# EAGLE design Dev_Board_V3.5 (EAGLE 6.2)
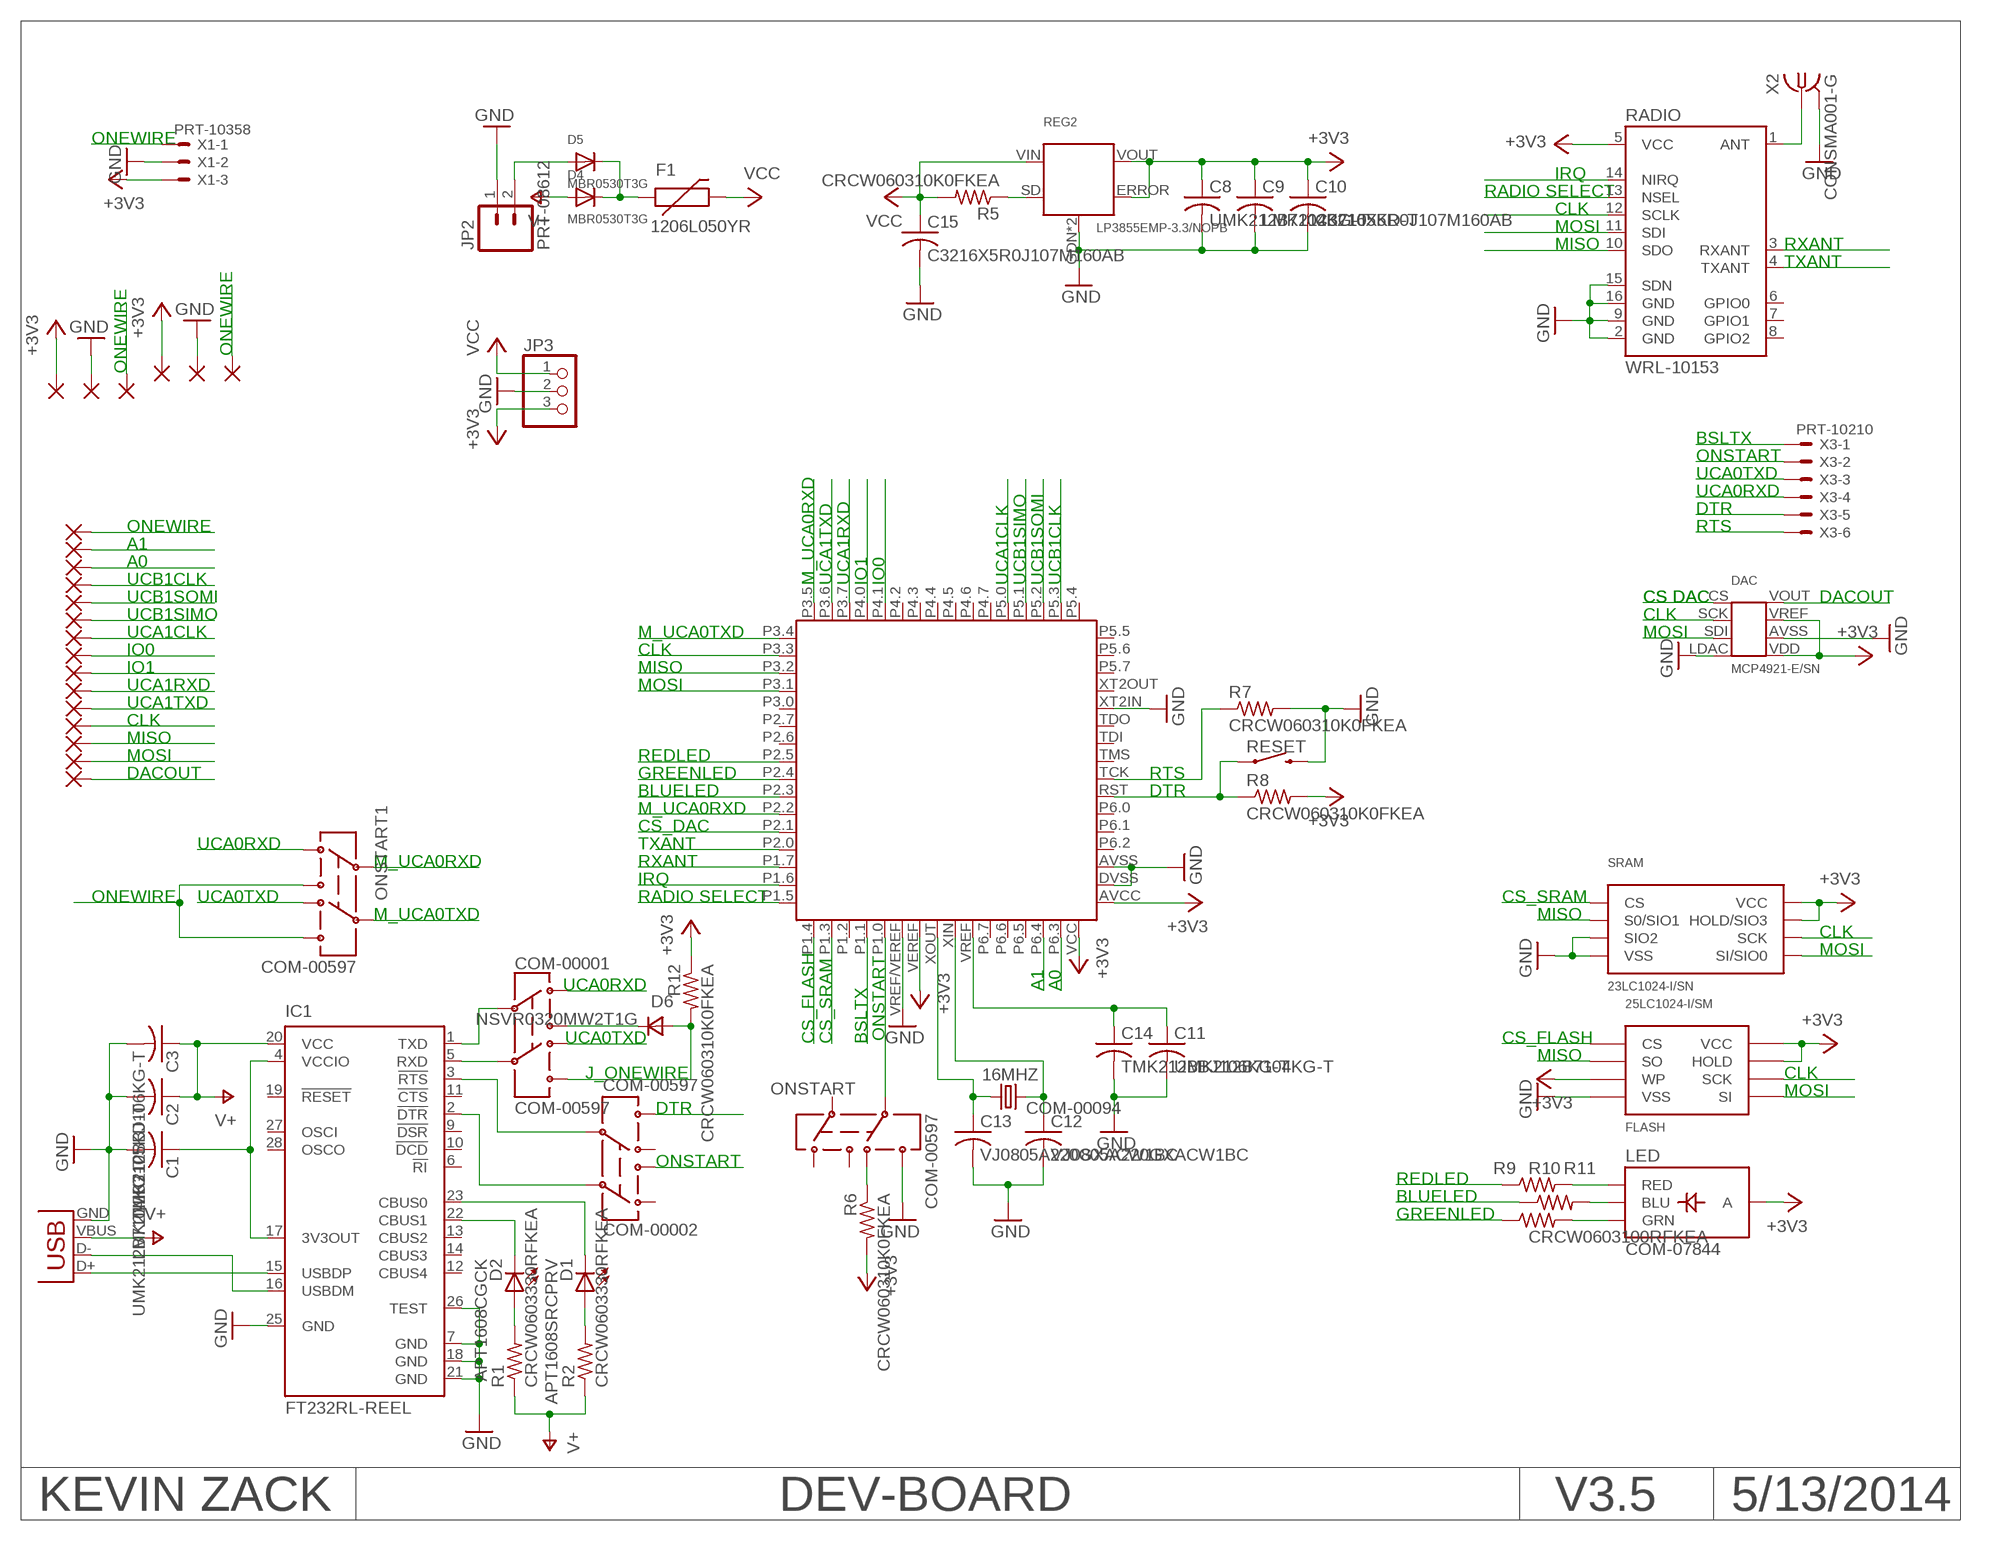
[diagram p0: schematic, sheet 1]

## Parts
16MHZ  COM-00094  CRYSTAL5X3  [CRYSTAL-SMD-5X3]
+3.1  1,6/0,9  [1,6/0,9]
+3.3  1,6/0,9  [1,6/0,9]
A0  1,6/0,9  [1,6/0,9]
A1  1,6/0,9  [1,6/0,9]
A2  1,6/0,9  [1,6/0,9]
A3  1,6/0,9  [1,6/0,9]
A4  1,6/0,9  [1,6/0,9]
C1  UMK212B7104KG-T  C-USC0805  [C0805]
C2  LMK212B7105KD-T  C-USC0805  [C0805]
C3  TMK212BBJ106KG-T  C-USC0805  [C0805]
C8  UMK212B7104KG-T  C-USC0805  [C0805]
C9  LMK212B7105KD-T  C-USC0805  [C0805]
C10  C3216X5R0J107M160AB  C-USC1206  [C1206]
C11  UMK212B7104KG-T  C-USC0805  [C0805]
C12  VJ0805A220GXACW1BC  C-USC0805  [C0805]
C13  VJ0805A220GXACW1BC  C-USC0805  [C0805]
C14  TMK212BBJ106KG-T  C-USC0805  [C0805]
C15  C3216X5R0J107M160AB  C-USC1206  [C1206]
CLK  1,6/0,9  [1,6/0,9]
COM-00001  COM-00597  SWITCH-DPDTAYZ0202  [AYZ0202]
COM-00002  COM-00597  SWITCH-DPDTAYZ0202  [AYZ0202]
D1  APT1608SRCPRV  LED-RED0603  [LED-0603]
D2  APT1608CGCK  LED-GREEN0603  [LED-0603]
D4  MBR0530T3G  DIODESOD-123  [SOD-123]
D5  MBR0530T3G  DIODESOD-123  [SOD-123]
D6  NSVR0320MW2T1G  DSOD323  [SOD323]
DAC  MCP4921-E/SN  MCP4921_SMD  [MCP4921_SMD]
DACOUT  1,6/0,9  [1,6/0,9]
F1  1206L050YR  PTCSMD  [PTC-1206]
FLASH  25LC1024-I/SM  25LC1024  [25LC1024]
GND  1,6/0,9  [1,6/0,9]
GND26  1,6/0,9  [1,6/0,9]
IC1  FT232RL-REEL  FT232RL  [SSOP28]
IO0  1,6/0,9  [1,6/0,9]
IO1  1,6/0,9  [1,6/0,9]
JP1  1734035-2  USB-SMD-NS  [USB-MINIB-NOSTOP]
JP2  PRT-08612  M02-JST-2MM-SMT  [JST-2-SMD]
JP3  PINHD-1X3  [1X03]
LED  COM-07844  LED-TRICOLOR  [LED-TRICOLOR-SMD]
MISO  1,6/0,9  [1,6/0,9]
MOSI  1,6/0,9  [1,6/0,9]
ONSTART  COM-00597  SWITCH-DPDTAYZ0202  [AYZ0202]
ONSTART1  COM-00597  SWITCH-DPDTAYZ0202  [AYZ0202]
R1  CRCW0603330RFKEA  R-US_R0603  [R0603]
R2  CRCW0603330RFKEA  R-US_R0603  [R0603]
R5  CRCW060310K0FKEA  R-US_R0603  [R0603]
R6  CRCW060310K0FKEA  R-US_R0603  [R0603]
R7  CRCW060310K0FKEA  R-US_R0603  [R0603]
R8  CRCW060310K0FKEA  R-US_R0603  [R0603]
R9  CRCW0603100RFKEA  R-US_R0603  [R0603]
R10  CRCW0603100RFKEA  R-US_R0603  [R0603]
R11  CRCW0603100RFKEA  R-US_R0603  [R0603]
R12  CRCW060310K0FKEA  R-US_R0603  [R0603]
RADIO  WRL-10153  RFM22SMD  [RFM22-XXX-S2]
REG2  LP3855EMP-3.3/NOPB  LP3855EMP  [LP3855EMP]
RESET  COM-08720  SWITCH-MOMENTARY-2SMD  [TACTILE_SWITCH_SMD]
SRAM  23LC1024-I/SN  23LC1024  [23LC1024]
U$3  MSP430F2410TPMR  MSP430F248  [MSP430F248]
UCA1CLK  1,6/0,9  [1,6/0,9]
UCA1RXD  1,6/0,9  [1,6/0,9]
UCA1TXD  1,6/0,9  [1,6/0,9]
UCB1CLK  1,6/0,9  [1,6/0,9]
UCB1SIMO  1,6/0,9  [1,6/0,9]
UCB1SOMI  1,6/0,9  [1,6/0,9]
X1  PRT-10358  BM03B-SRSS-TB  [BM03B-SRSS-TB]
X2  CONSMA001-G  BU-SMA-V  [BU-SMA-V]
X3  PRT-10210  SM06B-SRSS-TB  [SM06B-SRSS-TB]

## Nets
+3V3: +3.1.1(P) +3.3.1(P) C8.1 C9.1 C10.1 DAC.VDD DAC.VREF FLASH.HOLD FLASH.VCC FLASH.WP JP3.3 LED.A R6.2 R8.2 R12.1 RADIO.5(VCC) REG2.ERROR REG2.VOUT SRAM.HOLD/SIO3 SRAM.VCC U$3.AVCC U$3.VCC(DVCC) U$3.VEREF X1.3
A0: A0.1(P) U$3.P6.3
A1: A1.1(P) U$3.P6.4
BLUELED: R10.1 U$3.P2.3
BSLTX: U$3.P1.1 X3.1
CLK: CLK.1(P) DAC.SCK FLASH.SCK RADIO.12(SCLK) SRAM.SCK U$3.P3.3
CS_DAC: DAC.CS U$3.P2.1
CS_FLASH: FLASH.CS U$3.P1.4
CS_SRAM: SRAM.CS U$3.P1.3
CSRADIO: RADIO.13(NSEL) U$3.P1.5
DACOUT: DAC.VOUT DACOUT.1(P)
DTR: COM-00002.6 R8.1 RESET.1 U$3.RST X3.5
GND: C1.2 C2.2 C3.2 C8.2 C9.2 C10.2 C11.2 C12.2 C13.2 C14.2 C15.2 DAC.AVSS(VCC) DAC.LDAC(LADC) FLASH.VSS GND26.1(P) GND.1(P) IC1.7(GND) IC1.18(GND) IC1.21(GND) IC1.25(GND) IC1.26(TEST) JP1.GND JP2.1 JP3.2 ONSTART.6 R7.2 RADIO.2(GND) RADIO.9(GND) RADIO.15(SDN) RADIO.16(GND) REG2.GDN(GND) REG2.GND RESET.3 SRAM.SIO2 SRAM.VSS U$3.AVSS U$3.DVSS U$3.VREF/VEREF U$3.XT2IN X1.2 X2.2(GND)
GREENLED: R11.1 U$3.P2.4
IO0: IO0.1(P) U$3.P4.1
IO1: IO1.1(P) U$3.P4.0
IRQ: RADIO.14(NIRQ) U$3.P1.6
M_UCA0RXD: ONSTART1.2 U$3.P2.2 U$3.P3.5
M_UCA0TXD: ONSTART1.5 U$3.P3.4
MISO: FLASH.SO MISO.1(P) RADIO.10(SDO) SRAM.SO/SIO1(S0/SIO1) U$3.P3.2
MOSI: DAC.SDI FLASH.SI MOSI.1(P) RADIO.11(SDI) SRAM.SI/SIO0 U$3.P3.1
N$5: D1.C IC1.23(CBUS0)
N$7: IC1.16(USBDM) JP1.D-
N$8: IC1.15(USBDP) JP1.D+
N$9: C1.1 IC1.4(VCCIO) IC1.17(3V3OUT)
N$10: D2.C IC1.22(CBUS1)
N$11: D2.A R1.2
N$12: D1.A R2.2
N$13: R5.1 REG2.SD
N$14: D5.A JP2.2
N$15: COM-00001.5 IC1.5(RXD)
N$16: ONSTART.4 R6.1
N$17: LED.R(RED) R9.2
N$18: RADIO.1(ANT) X2.1
N$21: LED.B(BLU) R10.2
N$22: C11.1 C14.1 U$3.VREF
N$24: LED.G(GRN) R11.2
N$26: COM-00001.3 D6.1(C)
N$28: D4.C D5.C F1.1
N$29: COM-00002.5 IC1.3(!RTS)
N$30: 16MHZ.1 C13.1 U$3.XOUT
N$31: 16MHZ.3 C12.1 U$3.XIN
N$39: COM-00001.2 IC1.1(TXD)
N$43: COM-00001.6 D6.2(A) R12.2
N$44: COM-00002.2 IC1.2(!DTR)
ONEWIRE: A2.1(P) A3.1(P) A4.1(P) ONSTART1.3 ONSTART1.6 X1.1
ONSTART: COM-00002.3 ONSTART.5 U$3.P1.0 X3.2
REDLED: R9.1 U$3.P2.5
RTS: R7.1 U$3.TCK X3.6
RXANT: RADIO.3(RXANT) U$3.P1.7
TXANT: RADIO.4(TXANT) U$3.P2.0
UCA0RXD: COM-00001.1 ONSTART1.1 X3.4
UCA0TXD: COM-00001.4 ONSTART1.4 X3.3
UCA1CLK: U$3.P5.0 UCA1CLK.1(P)
UCA1RXD: U$3.P3.7 UCA1RXD.1(P)
UCA1TXD: U$3.P3.6 UCA1TXD.1(P)
UCB1CLK: U$3.P5.3 UCB1CLK.1(P)
UCB1SIMO: U$3.P5.1 UCB1SIMO.1(P)
UCB1SOMI: U$3.P5.2 UCB1SOMI.1(P)
V+: C2.1 C3.1 D4.A IC1.20(VCC) JP1.VBUS R1.1 R2.1
VCC: C15.1 F1.2 JP3.1 R5.2 REG2.VIN
Unconnected: COM-00002.1 COM-00002.4 IC1.6(!RI) IC1.9(!DSR) IC1.10(!DCD) IC1.11(!CTS) IC1.12(CBUS4) IC1.13(CBUS2) IC1.14(CBUS3) IC1.19(!RESET) IC1.27(OSCI) IC1.28(OSCO) ONSTART.1 ONSTART.2 ONSTART.3 RADIO.6(GPIO0) RADIO.7(GPIO1) RADIO.8(GPIO2) U$3.P1.2 U$3.P2.6 U$3.P2.7 U$3.P3.0 U$3.P4.2 U$3.P4.3 U$3.P4.4 U$3.P4.5 U$3.P4.6 U$3.P4.7 U$3.P5.4 U$3.P5.5 U$3.P5.6 U$3.P5.7 U$3.P6.0 U$3.P6.1 U$3.P6.2 U$3.P6.5 U$3.P6.6 U$3.P6.7 U$3.TDI U$3.TDO U$3.TMS U$3.XT2OUT

## Notes on the sheet
- ONEWIRE
- IRQ
- RADIO SELECT
- CLK
- MOSI
- MISO | RXANT
- TXANT
- ONEWIRE
- ONEWIRE
- BSLTX
- ONSTART
- UCA0TXD
- UCA0RXD
- DTR
- ONEWIRE | RTS
- A1
- A0
- UCB1CLK | M_UCA0RXD | UCA1TXD | UCA1RXD | IO1 | IO0 | UCA1CLK | UCB1SIMO | UCB1SOMI | UCB1CLK
- UCB1SOMI | CS DAC | CS DAC | DACOUT
- UCB1SIMO | CLK
- UCA1CLK | M_UCA0TXD | MOSI
- IO0 | CLK
- IO1 | MISO
- UCA1RXD | MOSI
- UCA1TXD
- CLK
- MISO
- MOSI | REDLED
- DACOUT | GREENLED | RTS
- BLUELED | DTR
- M_UCA0RXD
- CS_DAC
- UCA0RXD | TXANT
- M_UCA0RXD | RXANT
- IRQ
- ONEWIRE | UCA0TXD | RADIO SELECT | CS_SRAM
- M_UCA0TXD | MISO
- CLK
- ONSTART | MOSI
- UCA0RXD | A1 | A0
- UCA0TXD | CS_FLASH | CS_SRAM | BSLTX | CS_FLASH
- MISO
- J_ONEWIRE | CLK
- MOSI
- DTR
- ONSTART
- REDLED
- BLUELED
- GREENLED
- KEVIN ZACK | DEV-BOARD | V3.5 | 5/13/2014

## Power pins joined to a net without a drawn wire
GND: X2.3(GND) X2.4(GND) X2.5(GND)

## Library data of the parts
16MHZ = SparkFun-FreqCtrl:CRYSTAL: Various standard crystals. Proven footprints. Spark Fun Electronics SKU : COM-00534
+3.1 +3.3 A0 A1-A4 CLK DACOUT GND GND26 IO0 IO1 MISO MOSI UCA1CLK UCA1RXD UCA1TXD UCB1CLK UCB1SIMO UCB1SOMI = wirepad:1,6/0,9: THROUGH-HOLE PAD
C1-C3 C8-C15 = rcl:C-US: CAPACITOR, American symbol
COM-00001 COM-00002 ONSTART ONSTART1 = SparkFun-Electromechanical:SWITCH-DPDT: DPDT Version of the COM-00597; PROD_ID: SWCH-08179; VALUE: DPDT
D1 = SparkFun-LED:LED-RED: Assorted Red LEDs LilyPad 1206- DIO-09912 1206- DIO-00809 0603- DIO-00819; PROD_ID: DIO-00819; VALUE: RED
D2 = SparkFun-LED:LED-GREEN: Various green LEDs 0603- DIO-00821 LARGE- DIO-00862 LILYPAD- DIO-09910; PROD_ID: DIO-00821; VALUE: GREEN
D4 D5 = adafruit:DIODE: Diode SMADIODE - SMA Surface Mount Package 20V 1A Schottky Diode Digikey: 641-1014-6-ND DO-1N4148 - Through Hole Small Current Diode SOD-123 20V 1 A (.5mV Vf) Schottky Diode - Digikey: MBRX120TPMSCT-ND SOD-323 10V 570mA (.38mV Vf, 3ns) Schottky Diode - Digikey: ZLLS410CT-ND SOD-523 30V 30mA Schottky Diode (RB751S-40TE61) - Digikey: RB751S-40TE61CT-ND SOT23-R/W - SOT23 Package (R = Solder Paste/Reflow Ovens, W = Hand-Soldering) BAT54Film 40V 300mA - Digikey: 497-7162-1-ND
D6 = zetex:D: DIODE; MPN: CDSOD323-T05C; OC_FARNELL: 1824860; OC_NEWARK: 79R6078
DAC = PocketCube:MCP4921_SMD
F1 = SparkFun-PowerIC:PTC: Resettable Fuse PTC Resettable Fuse. Spark Fun Electronics SKU : COM-08357
FLASH = PocketCube:25LC1024
IC1 = ftdichip:FT232R: Source: http://www.ftdichip.com/Documents/DataSheets/DS_FT232R_v104.pdf; MPN: FT232RL; OC_FARNELL: 1146032; OC_NEWARK: 91K9918
JP1 = SparkFun-Connectors:USB: USB Connectors USB-B-PTH is fully proven SKU : PRT-00139/CONN-08278 USB-miniB is fully proven SKU : PRT-00587 USB-A-PCB is untested. USB-A-H is throughly reviewed, but untested. Spark Fun Electronics SKU : PRT-00437 USB-B-SMT is throughly reviewed, but untested. Needs silkscreen touching up. USB-A-S has not been used/tested USB-MB-H has not been used/tested USB-MICROB has been used. CONN-09505
JP2 = SparkFun-Connectors:M02: Header 2 Standard 2-pin 0.1" header. Use with straight break away headers (SKU : PRT-00116), right angle break away headers (PRT-00553), swiss pins (PRT-00743), machine pins (PRT-00117), and female headers (PRT-00115). Molex polarized connector foot print use with SKU : PRT-08233 with associated crimp pins and housings.; PROD_ID: CONN-08352
JP3 = adafruit:PINHD-1X3: PIN HEADER
LED = SparkFun-LED:LED-TRICOLOR: Tri-Color LED SMD Proven layout and schematic for triple color LED in SMD package - common anode. Spark Fun Electronics SKU : COM-07844
R1 R2 R5-R12 = rcl:R-US_: RESISTOR, American symbol
RADIO = SparkFun-RF:RFM22: The RFM22 is a low-power, low cost radio that is capable of operating in the 434MHz and 900MHz open bands. It's frequency is software defined and there are some very good libraries written for it.
REG2 = PocketCube:LP3855EMP
RESET = SparkFun-Electromechanical:SWITCH-MOMENTARY-2: Various NO switches- pushbuttons, reed, etc
SRAM = PocketCube:23LC1024
U$3 = PocketCube:MSP430F248
X1 = con-jst2:?M03B-SRSS-TB: Disconnectable Crimp style connector, 1.0mm pitch 3 contacts
X2 = con-coax:BU-SMA-V: FEMALE SMA CONNECTOR Radiall distributor RS 112-3794; OC_FARNELL: unknown; OC_NEWARK: unknown
X3 = con-jst2:?M06B-SRSS-TB: Disconnectable Crimp style connector, 1.0mm pitch 6 contacts

## Board
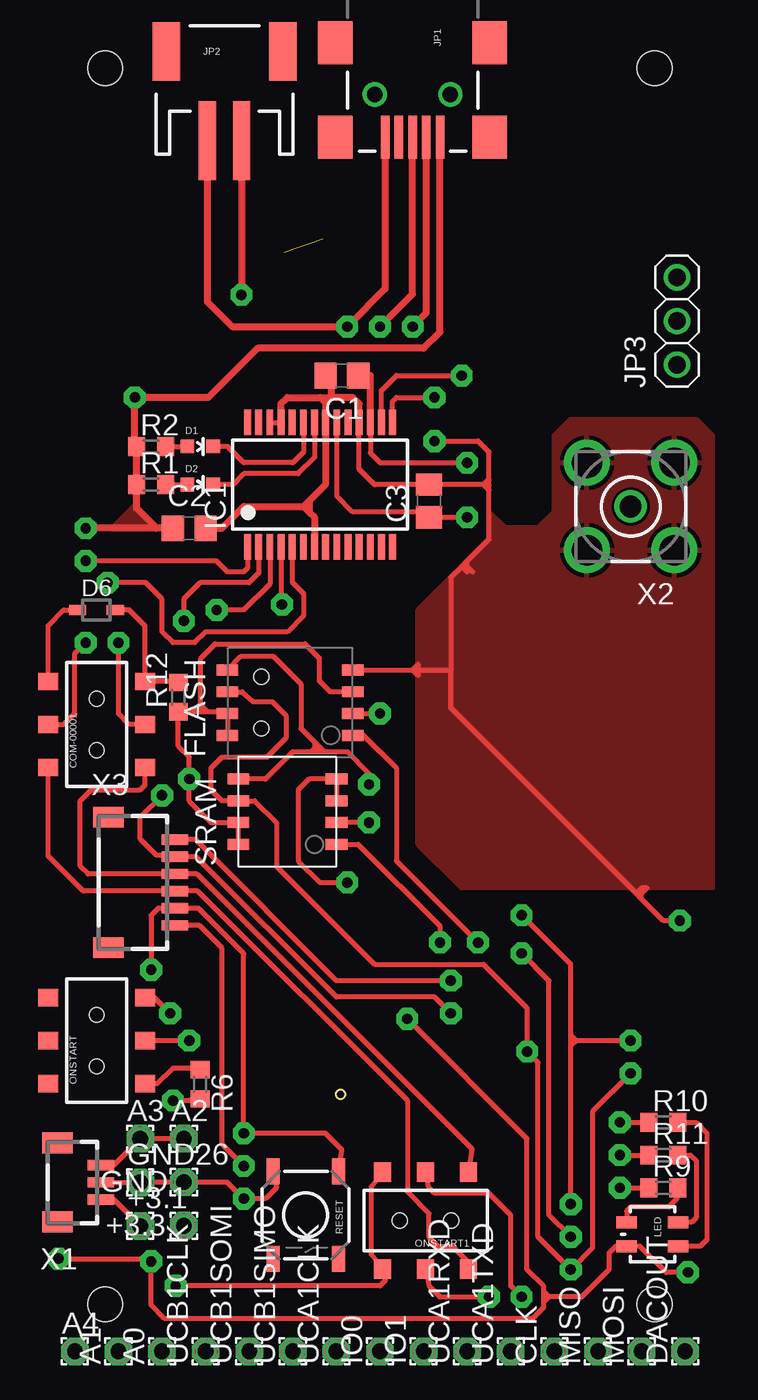
[diagram p1: board, top side]
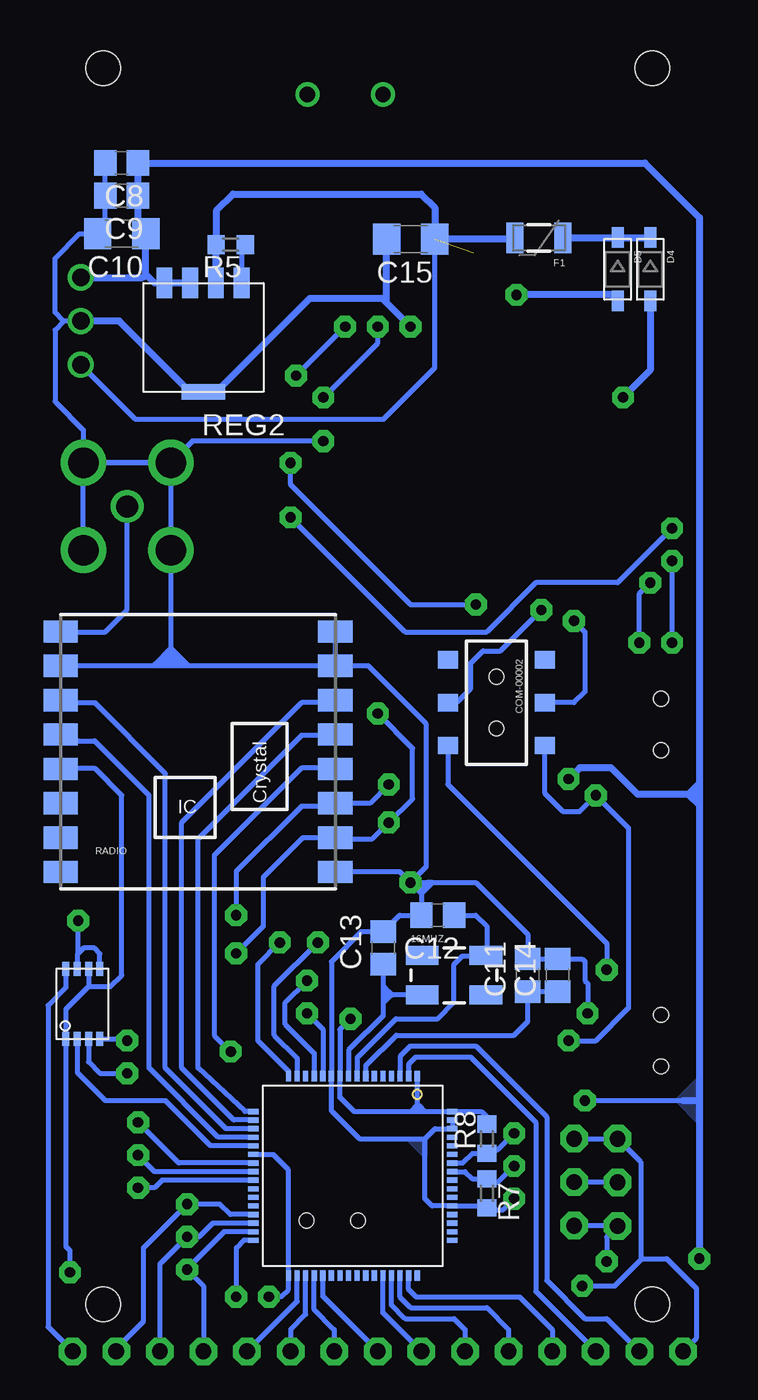
[diagram p2: board, bottom side, seen from below]

Size 0.5 x 0.5 mm. Coordinates in mm from the lower left corner, seen from the top.
Copper layers (1*16): Top 0.035mm / dielectric 1.5mm / Bottom 0.035mm
Design rules: minimum track width 10mil, minimum drill 24mil, track to track 6mil, track to pad 6mil, pad to pad 6mil, via to via 6mil, smd to smd 6mil, copper to edge 20mil, drill to drill 10mil, minimum pad ring 10mil, minimum via ring 8mil, stop-mask expansion 4mil, vias tented up to drill 0mil, thermal gap 10mil
Holes 2 mm at -13.46,-11.99 18.54,-11.99 18.54,60.01 -13.46,60.01

### Footprints (pad centres in the part's own frame; a part is rotated, then mirrored left to right if it is on the bottom)
CRYSTAL-SMD-5X3 = smd 1.9 x 1.1: 1 -1.85,-1.15; 2 1.85,-1.15; 3 1.85,1.15; 4 -1.85,1.15
1,6/0,9 = drill 0.914 pad 1.6 octagon: 1 0,0
C0805 = smd 1.3 x 1.5: 1 -0.95,0; 2 0.95,0
C1206 = smd 1.6 x 1.8: 1 -1.4,0; 2 1.4,0
AYZ0202 = smd 1 x 1.15: 1 -2.5,2.825; 2 0,2.825; 3 2.5,2.825; 4 -2.5,-2.825; 5 0,-2.825; 6 2.5,-2.825 | hole 0.85: 1.5,0; -1.5,0
LED-0603 = smd 0.8 x 0.8: A 0,-0.75; C 0,0.75
SOD-123 = smd 1.2 x 0.7: A 1.85,0; C -1.85,0
SOD323 = smd 1 x 0.6: 1 -1.1,0; 2 1.1,0
MCP4921_SMD = smd 0.813 x 0.406: AVSS 4.504,1.323; CS 0.414,1.322; LDAC 4.504,0.002; SCK 0.414,0.661; SDI 0.414,0.001; VDD 0.414,1.982; VOUT 4.504,1.983; VREF 4.504,0.662
PTC-1206 = smd 1 x 1.8: 1 -1.4,0; 2 1.4,0
25LC1024 = smd 0.635 x 1.27: CS 0,0; HOLD 1.27,7.303; SCK 2.54,7.303; SI 3.81,7.303; SO 1.27,0; VCC 0,7.303; VSS 3.81,0; WP 2.54,0
SSOP28 = smd 0.4 x 1.5: 1 -4.225,-3.625; 2 -3.575,-3.625; 3 -2.925,-3.625; 4 -2.275,-3.625; 5 -1.625,-3.625; 6 -0.975,-3.625; 7 -0.325,-3.625; 8 0.325,-3.625; 9 0.975,-3.625; 10 1.625,-3.625; 11 2.275,-3.625; 12 2.925,-3.625; 13 3.575,-3.625; 14 4.225,-3.625; 15 4.225,3.625; 16 3.575,3.625; 17 2.925,3.625; 18 2.275,3.625; 19 1.625,3.625; 20 0.975,3.625; 21 0.325,3.625; 22 -0.325,3.625; 23 -0.975,3.625; 24 -1.625,3.625; 25 -2.275,3.625; 26 -2.925,3.625; 27 -3.575,3.625; 28 -4.225,3.625
USB-MINIB-NOSTOP = smd 2.5 x 0.5: D+ 2.5,0; D- 2.5,0.8; GND 2.5,-1.6; ID 2.5,-0.8; VBUS 2.5,1.6 | smd 2.5 x 2: G1 -3,-4.5; G2 -3,4.5; G3 2.5,4.5; G4 2.5,-4.5 | drill 0.9 pad 0.8: H1 0,2.2 | drill 0.9 pad 0.787: H2 0,-2.2
JST-2-SMD = smd 1 x 4.6: 1 -1,-3.7; 2 1,-3.7 | smd 1.6 x 3.4: NC1 -3.4,1.5; NC2 3.4,1.5
1X03 = drill 1.016: 1 -2.54,0; 2 0,0; 3 2.54,0
LED-TRICOLOR-SMD = smd 0.7 x 1.2: A 0.7,-1.5; B 0.7,1.5; G -0.7,1.5; R -0.7,-1.5
R0603 = smd 1 x 1.1: 1 -0.85,0; 2 0.85,0
RFM22-XXX-S2 = smd 2 x 1.3: 1 -8,7; 2 -8,5; 3 -8,3; 4 -8,1; 5 -8,-1; 6 -8,-3; 7 -8,-5; 8 -8,-7; 9 8,-7; 10 8,-5; 11 8,-3; 12 8,-1; 13 8,1; 14 8,3; 15 8,5; 16 8,7
LP3855EMP = smd 0.914 x 1.778: ERROR 4.5,0; SD 0,0; VIN 1.5,0; VOUT 3,0 | smd 1.778 x 0.914: GDN 2.603,6.35; GND 1.841,6.35
TACTILE_SWITCH_SMD = smd 1.524 x 0.762: 1 -2.54,1.905; 2 2.54,1.905; 3 -2.54,-1.905; 4 2.54,-1.905
23LC1024 = smd 0.635 x 1.27: CS 0,0; HOLD/SIO3 1.27,5.715; SCK 2.54,5.715; SI/SIO0 3.81,5.715; SIO2 2.54,0; SO/SIO1 1.27,0; VCC 0,5.715; VSS 3.81,0
MSP430F248 = smd 0.305 x 0.61: AVCC 0,11.85; AVSS 1,11.85; DVSS 0.5,11.85; P1.5 0,0.25; P1.6 0.5,0.25; P1.7 1,0.25; P2.0 1.5,0.25; P2.1 2,0.25; P2.2 2.5,0.25; P2.3 3,0.25; P2.4 3.5,0.25; P2.5 4,0.25; P2.6 4.5,0.25; P2.7 5,0.25; P3.0 5.5,0.25; P3.1 6,0.25; P3.2 6.5,0.25; P3.3 7,0.25; P3.4 7.5,0.25; P5.5 7.5,11.85; P5.6 7,11.85; P5.7 6.5,11.85; P6.0 2.5,11.85; P6.1 2,11.85; P6.2 1.5,11.85; RST 3,11.85; TCK 3.5,11.85; TDI 4.5,11.85; TDO 5,11.85; TMS 4,11.85; XT2IN 5.5,11.85; XT2OUT 6,11.85 | smd 0.61 x 0.305: P1.0 -2.05,4.3; P1.1 -2.05,3.8; P1.2 -2.05,3.3; P1.3 -2.05,2.8; P1.4 -2.05,2.3; P3.5 9.55,2.3; P3.6 9.55,2.8; P3.7 9.55,3.3; P4.0 9.55,3.8; P4.1 9.55,4.3; P4.2 9.55,4.8; P4.3 9.55,5.3; P4.4 9.55,5.8; P4.5 9.55,6.3; P4.6 9.55,6.8; P4.7 9.55,7.3; P5.0 9.55,7.8; P5.1 9.55,8.3; P5.2 9.55,8.8; P5.3 9.55,9.3; P5.4 9.55,9.8; P6.3 -2.05,9.3; P6.4 -2.05,8.8; P6.5 -2.05,8.3; P6.6 -2.05,7.8; P6.7 -2.05,7.3; VCC -2.05,9.8; VEREF -2.05,5.3; VREF -2.05,6.8; VREF/VEREF -2.05,4.8; XIN -2.05,6.3; XOUT -2.05,5.8
BM03B-SRSS-TB = smd 0.6 x 1.55: 1 1,-1.625; 2 0,-1.625; 3 -1,-1.625 | smd 1.2 x 1.8: FIT@1 2.3,0.9; FIT@2 -2.3,0.9
BU-SMA-V = drill 1.27: 1 0,0 | drill 1.778: 2 -2.55,2.55; 3 2.55,2.55; 4 2.55,-2.55; 5 -2.55,-2.55
SM06B-SRSS-TB = smd 0.6 x 1.55: 1 -2.5,2.975; 2 -1.5,2.975; 3 -0.5,2.975; 4 0.5,2.975; 5 1.5,2.975; 6 2.5,2.975 | smd 1.2 x 1.8: FIT@1 -3.8,-0.9; FIT@2 3.8,-0.9

### Placement (x,y rotation side)
16MHZ  -1.9,7.19 0 bottom  (outside the outline)
+3.1  -11.43,-7.42 0 top  (outside the outline)
+3.3  -8.89,-7.4 90 top  (outside the outline)
A0  -10.16,-14.72 90 top  (outside the outline)
A1  -12.7,-14.72 90 top  (outside the outline)
A2  -8.89,-2.34 0 top  (outside the outline)
A3  -11.43,-2.34 0 top  (outside the outline)
A4  -15.24,-14.72 0 top  (outside the outline)
C1  0.32,42.11 180 top  (outside the outline)
C2  -8.57,33.22 0 top  (outside the outline)
C3  5.4,34.81 90 top  (outside the outline)
C8  17.47,54.49 180 bottom  (outside the outline)
C9  17.47,52.59 180 bottom  (outside the outline)
C10  17.47,50.37 180 bottom  (outside the outline)
C11  -6.19,7.19 90 bottom  (outside the outline)
C12  -0.95,10.68 180 bottom  (outside the outline)
C13  2.23,8.77 90 bottom  (outside the outline)
C14  -7.93,7.19 90 bottom  (outside the outline)
C15  0.63,50.05 180 bottom  (outside the outline)
CLK  12.7,-14.72 90 top  (outside the outline)
COM-00001  -13.97,21.79 90 top  (outside the outline)
COM-00002  -4.36,23.06 270 bottom  (outside the outline)
D1  -7.93,37.98 270 top  (outside the outline)
D2  -7.93,35.76 270 top  (outside the outline)
D4  -13.33,48.3 270 bottom  (outside the outline)
D5  -11.43,48.3 270 bottom  (outside the outline)
D6  -13.97,28.46 0 top  (outside the outline)
DAC  18.74,3.06 90 bottom  (outside the outline)
DACOUT  20.32,-14.72 90 top  (outside the outline)
F1  -6.84,50.13 180 bottom  (outside the outline)
FLASH  0.96,21.16 90 top  (outside the outline)
GND  -8.89,-4.86 90 top  (outside the outline)
GND26  -11.43,-4.88 0 top  (outside the outline)
IC1  -0.95,35.76 0 top  (outside the outline)
IO0  2.54,-14.72 90 top  (outside the outline)
IO1  5.08,-14.72 90 top  (outside the outline)
JP1  4.44,58.49 270 top  (outside the outline)
JP2  -6.51,59.5 0 top  (outside the outline)
JP3  19.85,45.29 90 top  (outside the outline)
LED  18.42,-7.89 270 top  (outside the outline)
MISO  15.24,-14.72 90 top  (outside the outline)
MOSI  17.78,-14.72 90 top  (outside the outline)
ONSTART  -13.97,3.38 90 top  (outside the outline)
ONSTART1  5.2,-7.1 180 top  (outside the outline)
R1  -10.79,35.76 0 top  (outside the outline)
R2  -10.79,37.98 0 top  (outside the outline)
R5  11.12,49.73 180 bottom  (outside the outline)
R6  -7.93,0.84 270 top  (outside the outline)
R7  -3.81,-5.51 270 bottom  (outside the outline)
R8  -3.81,-2.34 90 bottom  (outside the outline)
R9  19.05,-5.2 0 top  (outside the outline)
R10  19.05,-1.39 0 top  (outside the outline)
R11  19.05,-3.29 0 top  (outside the outline)
R12  -9.2,23.38 90 top  (outside the outline)
RADIO  13.02,20.2 0 bottom  (outside the outline)
REG2  10.48,47.51 180 bottom  (outside the outline)
RESET  -1.79,-6.78 270 top  (outside the outline)
SRAM  0,14.81 90 top  (outside the outline)
U$3  10.05,-0.75 270 bottom
UCA1CLK  0,-14.72 90 top  (outside the outline)
UCA1RXD  7.62,-14.72 90 top  (outside the outline)
UCA1TXD  10.16,-14.72 90 top  (outside the outline)
UCB1CLK  -7.62,-14.72 90 top  (outside the outline)
UCB1SIMO  -2.54,-14.72 90 top  (outside the outline)
UCB1SOMI  -5.08,-14.72 90 top  (outside the outline)
X1  -15.35,-4.88 90 top  (outside the outline)
X2  17.15,34.49 180 top  (outside the outline)
X3  -12.38,12.58 270 top  (outside the outline)

### Tracks (layer width: path | path; a pad name or v marks a point on that pad's centre or on a via)
+3V3  (via drill 0.6 pad 1.27)
  Top 0.305: FLASH.VCC FLASH.HOLD -6.45,22.53 -7.5,22.53 | SRAM.VCC SRAM.HOLD/SIO3 -7.3,16.08 -8.57,17.35 v-8.57,18.62 -8.57,19.89 -9.2,20.52 R12.1 | X1.3 -12.97,-5.88 +3.1.1 | v-9.52,-0.12 -8.57,-0.12 R6.2 | v4.13,4.65 11.12,-2.34 11.12,-9.96 12.07,-10.91 12.07,-11.23 | 12.07,-11.55 12.07,-11.86 | 12.07,-11.86 12.07,-12.18 11.43,-12.82 -10,-12.82 -10.79,-12.02 v-10.79,-9.48 -10.95,-9.32 v-16.19,-9.32 | -7.93,22.53 -8.35,22.53 | -8.35,22.53 R12.1 | FLASH.WP -0.35,23.7 -1,24.34 -1,25.67 -1.81,26.48 -7.06,26.48 -7.93,25.6 -7.93,22.97 | -7.93,22.94 -7.93,22.53 | -7.5,22.53 -7.93,22.53 | -8.35,22.53 -7.93,22.94 | -7.93,22.94 -7.93,22.97 | -7.5,22.53 -7.93,22.97 | -9.2,21.79 R12.1 | 12.39,-11.55 14.29,-11.55 15.88,-9.96 15.88,-9.01 16.29,-8.59 LED.A 17.69,-8.59 19.21,-10.12 v20.48,-10.12 | 12.39,-11.55 12.07,-11.55 | 12.39,-11.55 12.07,-11.23 | 12.07,-11.23 12.07,-11.55 | 12.39,-11.55 12.07,-11.86
  Bottom 0.305: 0.63,-0.75 3.93,-0.75 4.75,0.07 U$3.VEREF 4.75,4.03 v4.13,4.65 | 0.63,-0.75 0.25,-0.75 | 0.25,-0.75 -0.19,-0.75 | -0.19,-0.75 U$3.AVCC -3.49,-0.75 -3.81,-1.07 R8.2 -3.91,-1.39 | RADIO.5 20.43,19.25 19.05,19.25 17.47,17.66 17.47,7.19 18.13,6.52 19.4,6.52 | DAC.VREF 19.4,6.52 | 19.4,6.52 20.72,5.2 DAC.VDD 20.72,-8.61 20.48,-8.85 v20.48,-10.12 | v-9.52,-0.12 -15.24,-0.12 -15.87,-0.12 | C10.1 16.52,50.82 | +3.3.1 -8.9,-7.42 +3.1.1 -10.79,-8.05 v-10.79,-9.48 | U$3.VCC 0.25,-0.37 | 0.25,-0.37 0.25,-0.75 | 0.25,-0.37 0.63,-0.75 | 0.25,-0.37 0.19,-0.37 -0.19,-0.75
  Bottom 0.406: 16.07,48.01 15.56,47.51 REG2.ERROR REG2.VOUT | 16.07,48.01 C10.1 | 16.52,50.82 C9.1 C8.1 -13.01,54.49 -16.19,51.32 -16.19,18.36 | -16.19,18.36 -16.19,17.09 | -16.19,17.09 -16.19,-0.12 | -16.19,-0.12 v-16.19,-9.32 | -15.24,-0.12 -16.19,-0.12 | -15.55,17.73 -15.87,18.05 | -15.87,18.05 -16.19,18.36 | -15.55,17.73 -16.19,17.09 | -16.19,17.09 -15.87,18.05 | v-8.57,18.62 -9.22,19.27 -11.06,19.27 -12.59,17.73 -15.55,17.73 | JP3.3 16.25,47.83 16.07,48.01
  pour Bottom: -16.19,-1.39 -14.92,-0.12 -16.19,1.15
A0
  Bottom 0.305: A0.1 -6.66,-11.23 -6.66,-1.39 -2.85,2.42 0.32,2.42 0.75,2 U$3.P6.3
A1
  Bottom 0.305: A1.1 -10.79,-12.82 -9.52,-12.82 -7.3,-10.59 -7.3,-1.07 -3.17,3.06 0.64,3.06 1.25,2.45 U$3.P6.4
BLUELED  (via drill 0.6 pad 1.27)
  Top 0.305: v16.51,-1.39 R10.1
  Bottom 0.305: U$3.P2.3 14.15,-3.75 v16.51,-1.39
BSLTX  (via drill 0.6 pad 1.27)
  Top 0.305: v6.67,6.87 0,6.87 -8.21,15.08 X3.1
  Bottom 0.305: v6.67,6.87 7.94,5.6 7.94,4.33 6.25,2.64 U$3.P1.1
CLK  (via drill 0.6 pad 1.27)
  Top 0.305: v17.15,1.47 14.93,-0.75 14.93,-8.69 v13.66,-9.96 11.75,-8.05 11.75,2.11 v11.12,2.74 11.12,5.28 8.58,7.82 2.23,7.82 -3.49,13.54 -3.49,16.08 -4.76,17.35 SRAM.SCK -6.66,17.35 -7.3,17.98 -7.3,19.25 -6.66,19.89 -4.03,19.89 -2.93,20.99 -2.93,22.31 -3.74,23.13 -4.86,23.13 -5.48,23.7 FLASH.SCK
  Bottom 0.305: U$3.P3.3 11.51,-7.75 13.72,-9.96 v13.66,-9.96 12.7,-10.91 CLK.1 | RADIO.12 4.43,19.25 6.99,19.25 12.07,14.17 12.07,3.69 v11.12,2.74 | DAC.SCK 19.4,2.13 18.74,1.47 v17.15,1.47
CS_DAC
  Bottom 0.305: U$3.P2.1 12.29,-2.75 14.93,-0.12 18.42,-0.12 20.06,1.52 DAC.CS
CS_FLASH  (via drill 0.6 pad 1.27)
  Top 0.305: FLASH.CS 1.59,21.16 3.5,19.25 3.5,13.85 v8.26,9.09
  Bottom 0.305: v8.26,9.09 9.53,7.82 9.53,3.38 7.75,1.6 U$3.P1.4
CS_SRAM  (via drill 0.6 pad 1.27)
  Top 0.305: SRAM.CS 1.27,14.81 6.04,10.04 v6.04,9.09
  Bottom 0.305: v6.04,9.09 8.58,6.55 8.58,3.69 7.25,2.37 U$3.P1.3
CSRADIO
  Bottom 0.305: RADIO.13 4.43,21.16 6.99,21.16 13.02,15.12 13.02,1.79 10.28,-0.75 U$3.P1.5
DACOUT
  Bottom 0.305: DAC.VOUT 20.72,6.47 21.75,5.44 21.75,-13.29 DACOUT.1
DTR  (via drill 0.6 pad 1.27)
  Top 0.305: X3.5 -8.02,11.08 -5.39,8.46 v-5.39,-2.02 -0.63,-2.02 0.32,-2.97 RESET.1 | X3.5 -9.49,11 | X3.5 -10.39,11.08 -10.79,10.68 v-10.79,7.5
  Bottom 0.305: U$3.RST -2.39,-3.75 -2.96,-3.19 R8.1 -3.81,-2.97 -4.44,-2.97 v-5.39,-2.02 | v-10.79,7.5 -10.79,9.05 -1.54,18.31 COM-00002.6
GND  (via drill 0.6 pad 1.27)
  Top 0.305: C1.2 -0.31,42.11 | IC1.26 IC1.25 | IC1.21 -0.63,39.38 | IC1.18 1.33,36.66 2.23,35.76 C3.2 8.89,35.76 | RESET.3 -3.49,-5.2 -4.12,-5.83 v-5.39,-5.83 -6.36,-4.86 GND.1 -8.9,-4.88 GND26.1 X1.2 | v20.01,10.36 19.05,10.36 17.78,11.63 | FLASH.VSS 4.45,24.97 | 4.45,24.97 6.67,24.97 | 6.67,24.97 6.67,30.36 7.31,31 | SRAM.SIO2 SRAM.VSS -1.58,18.62 -2.22,17.98 -2.22,13.85 -0.95,12.58 v0.64,12.58 | 17.78,11.63 17.47,11.95 | 17.47,11.95 6.67,22.74 6.67,24.97 | v5.72,38.3 8.26,38.3 8.89,37.67 8.89,36.08 | 7.31,31 7.62,31.32 | 7.62,31.32 8.89,32.59 8.89,35.45 | 7.31,31 7.62,30.68 7.62,31 | 7.62,31 7.62,31.32 | 7.62,31 7.94,30.68 | 8.89,35.45 8.89,35.76 | 8.89,35.76 8.89,36.08 | 8.89,36.08 8.58,35.76 8.89,35.45 | 17.78,11.63 17.78,11.95 18.1,12.27 17.78,12.27 17.47,11.95 | 4.45,24.97 4.77,25.28 4.77,24.65 4.45,24.97 | v-9.68,4.96 -10.59,5.88 ONSTART.6
  Top 0.406: IC1.18 1.33,40.47 0.96,40.84 -0.31,40.84 | -0.31,40.84 -0.62,40.53 | -0.62,40.53 IC1.21 | -0.31,42.11 -0.31,40.84 | IC1.25 -3.22,40.47 -2.85,40.84 -0.93,40.84 | -0.93,40.84 -0.62,40.53 | C2.2 -6.66,33.22 -5.39,34.49 -1.9,34.49 | -1.9,34.49 -1.58,34.17 | -1.58,34.17 -1.27,33.86 IC1.7 | -0.63,39.38 -0.63,35.76 -1.58,34.81 | -1.58,34.81 -1.9,34.49 | -0.93,40.84 -0.31,40.84 | -1.58,34.81 -1.58,34.17 | JP2.1 -7.51,46.4 -6.08,44.97 v0.64,44.97 2.84,47.17 JP1.GND
  Bottom 0.305: U$3.DVSS U$3.AVSS -0.79,-1.75 -0.2,-2.34 | X2.2 X2.5 | X2.4 X2.5 | X2.4 X2.3 14.61,26.24 | RADIO.15 RADIO.16 5.1,27.2 | -0.2,-2.34 -0.2,-5.83 -0.62,-6.25 U$3.XT2IN -3.69,-6.25 R7.2 -3.91,-6.47 -4.76,-6.47 v-5.39,-5.83 | -0.2,-2.34 3.61,-2.34 5.25,-0.7 U$3.VREF/VEREF 5.25,7.97 3.5,9.73 C13.2 1.27,10.68 C12.2 0,11.95 | 19.13,25.2 RADIO.2 14.61,25.2 | DAC.LDAC 18.74,8.46 19.05,8.77 19.69,8.77 20.01,8.46 | 20.01,8.46 20.06,8.4 DAC.AVSS | 20.01,8.46 v20.01,10.36 | v0.64,12.58 1.26,13.2 RADIO.9 | v0.64,12.58 0,11.95 | v0.64,12.58 -0.31,12.58 | 0,11.95 -0.63,12.58 | -0.63,12.58 -0.31,12.58 | -0.31,12.58 0,12.27 | RADIO.15 14.61,25.2 | 14.61,26.24 14.61,25.92 | 14.61,25.92 14.61,25.6 | 14.61,25.6 14.61,25.2 | 14.61,26.24 13.66,25.28 | 14.61,26.24 15.56,25.28 15.24,25.28 | 15.24,25.28 14.93,25.28 | 14.93,25.28 14.29,25.28 | 14.29,25.28 13.97,25.28 14.29,25.6 | 14.29,25.6 14.61,25.92 | 14.61,25.92 14.93,25.6 | 15.24,25.28 14.93,25.6 | 14.61,25.6 14.29,25.6 | 14.29,25.6 14.29,25.28 | 14.29,25.28 14.61,25.6 | 14.61,25.6 14.93,25.6 | 14.93,25.6 14.93,25.28 | 14.93,25.28 14.61,25.6 | C8.2 C9.2 18.42,50.82 C10.2 19.92,50.37 21.35,48.93 21.35,45.81 20.83,45.29 | X2.5 19.69,37.03 X2.4 14.61,31.95 | v5.72,38.3 13.34,38.3 X2.4 | X2.5 19.7,38.95 21.35,40.6 21.35,44.77 20.83,45.29 | 11.8,41.16 REG2.GND REG2.GDN | GND26.1 -8.89,-4.88 | -0.63,12.58 -3.17,12.58 -6.19,9.57 C11.2 -6.35,8.14 -8.09,8.14 C14.2 -9.36,8.14 -9.52,7.98 -9.52,6.87 -9.68,6.71 v-9.68,4.96 | v0.64,12.58 -0.29,13.51 -0.29,21.82 3.1,25.2 RADIO.15 | JP3.2 20.83,45.29
  Bottom 0.406: REG2.GDN 13.48,41.16 17.61,45.29 JP3.2 | v0.64,44.97 2.03,46.36 | 2.03,46.36 C15.2 | 2.03,46.36 2.26,46.6 6.52,46.6 11.71,41.4 REG2.GND
  pour Bottom: -0.2,-2.34 -0.2,-3.29 0.75,-2.34
  pour Top: 7.31,12.27 4.77,14.81 4.77,28.46 8.89,32.59 12.7,32.59 12.7,38.62 13.66,39.57 20.96,39.57 21.91,38.62 21.91,12.27
  pour Top: 12.7,34.17 11.75,33.22 9.85,33.22 8.89,34.17 8.89,32.27 12.7,32.27
GREENLED  (via drill 0.6 pad 1.27)
  Top 0.305: v16.51,-3.29 R11.1
  Bottom 0.305: U$3.P2.4 15.55,-4.25 v16.51,-3.29
IO0
  Bottom 0.305: IO0.1 5.75,-11.51 U$3.P4.1
IO1
  Bottom 0.305: IO1.1 5.08,-13.45 6.25,-12.28 U$3.P4.0
IRQ
  Bottom 0.305: RADIO.14 4.53,23.06 6.99,23.06 13.97,16.08 13.97,1.79 10.93,-1.25 U$3.P1.6
M_UCA0RXD  (via drill 0.6 pad 1.27)
  Top 0.305: ONSTART1.2 5.4,-10.91 6.04,-11.55 v8.89,-11.55
  Bottom 0.305: U$3.P2.2 8.65,-3.25 7.75,-4.15 U$3.P3.5 7.75,-11.13 8.14,-11.52 8.87,-11.52 v8.89,-11.55
M_UCA0TXD  (via drill 0.6 pad 1.27)
  Top 0.305: v10.8,-11.55 10.16,-10.91 10.16,-6.78 8.89,-5.51 5.72,-5.51 5.4,-5.2 ONSTART1.5
  Bottom 0.305: 9.84,-8.25 U$3.P3.4 10.36,-8.25 10.79,-8.68 arc-90 10.8,-8.69 v10.8,-11.55
MISO  (via drill 0.6 pad 1.27)
  Top 0.305: v1.91,16.08 SRAM.SO/SIO1 | v13.66,-8.05 12.39,-6.78 12.39,6.87 v10.8,8.46 | FLASH.SO v2.54,22.43
  Bottom 0.305: U$3.P3.2 12.17,-7.25 12.97,-8.05 v13.66,-8.05 15.24,-9.64 MISO.1 | RADIO.10 4.31,15.12 2.86,15.12 v1.91,16.08 0.52,17.46 0.52,20.41 v2.54,22.43 | RADIO.10 4.47,15.12 | v10.8,8.46 9.21,10.04 9.21,12.9 6.91,15.2 RADIO.10
MOSI  (via drill 0.6 pad 1.27)
  Top 0.305: SRAM.SI/SIO0 -4.12,18.62 -2.54,20.2 -1.45,20.2 | v13.66,-6.15 13.66,3.06 | 13.66,3.06 13.66,3.38 | 13.66,3.38 13.66,3.69 | 13.66,3.69 13.66,7.82 v10.8,10.68 | v1.91,18.3 1.91,18.93 0.64,20.2 -0.72,20.2 | v17.15,3.38 13.97,3.38 | 13.97,3.38 13.66,3.38 | 13.66,3.69 13.97,3.38 | 13.97,3.38 13.66,3.06 | FLASH.SI -5.55,25.77 -3.69,25.77 -2.07,24.14 -2.07,21.55 -1.25,20.74 | -1.25,20.74 -0.72,20.2 | -1.45,20.2 -0.72,20.2 | -1.45,20.2 -1.23,20.42 | -1.23,20.42 -1.15,20.5 -1.15,20.59 | -1.23,20.42 -1.25,20.44 -1.25,20.74
  Bottom 0.305: U$3.P3.1 11.15,-6.75 11.75,-6.15 v13.66,-6.15 16.2,-8.69 16.2,-12.97 17.78,-14.56 MOSI.1 | RADIO.11 4.24,17.35 | RADIO.11 4.56,17.03 6.99,17.03 10.8,13.22 v10.8,10.68 | v1.91,18.3 3,17.2 RADIO.11 | DAC.SDI 17.25,3.47 v17.15,3.38
N$5
  Top 0.305: IC1.23 -1.9,39.36 -1.9,37.67 -2.54,37.03 -5.39,37.03 -6.35,37.98 D1.C
N$7  (via drill 0.6 pad 1.27)
  Top 0.305: IC1.16 2.63,41.24 3.5,42.11 v7.31,42.11 | 4.45,44.98 v4.45,44.97
  Top 0.406: 4.45,44.98 5.24,45.78 JP1.D-
  Bottom 0.305: v7.31,42.11 v4.45,44.97
N$8  (via drill 0.6 pad 1.27)
  Top 0.305: IC1.15 3.28,40.62 3.5,40.84 v5.72,40.84
  Top 0.406: v2.54,44.97 4.44,46.87 JP1.D+
  Bottom 0.305: v5.72,40.84 2.54,44.02 v2.54,44.97
N$9  (via drill 0.6 pad 1.27)
  Top 0.305: IC1.17 1.98,37.6 2.54,37.03 v7.62,37.03 | IC1.4 -3.22,28.83 v-3.17,28.78
  Top 0.406: IC1.17 1.98,42.11 C1.1
  Bottom 0.305: v-3.17,28.78 0.64,28.78 7.62,35.76 v7.62,37.03
N$10
  Top 0.305: IC1.22 -1.27,37.35 -2.22,36.4 -5.39,36.4 -6.03,35.76 D2.C
N$11
  Top 0.305: R1.2 D2.A
N$12
  Top 0.305: R2.2 D1.A
N$13
  Bottom 0.305: R5.1 10.48,49.52 REG2.SD
N$14  (via drill 0.6 pad 1.27)
  Top 0.406: JP2.2 -5.51,46.82 v-5.53,46.82
  Bottom 0.406: D5.A -11.06,46.82 v-5.53,46.82
N$15  (via drill 0.6 pad 1.27)
  Top 0.305: IC1.5 -2.57,30.09 -1.9,29.41 -1.9,28.14 -2.85,27.19 -7.62,27.19 -8.25,26.55 -9.52,26.55 -10.16,27.19 -10.16,29.09 -11.11,30.05 v-13.33,30.05 | COM-00001.5 -12.06,21.79 -12.7,22.43 v-12.7,26.55
  Bottom 0.305: v-12.7,26.55 -12.7,29.41 v-13.33,30.05
N$16
  Top 0.305: ONSTART.4 -10.43,0.88 -9.52,1.79 -8.04,1.79 R6.1
N$17
  Top 0.305: 20.01,-5.3 R9.2 19.85,-5.25 19.85,-5.83 19.37,-6.31 17.15,-6.31 16.92,-6.54 LED.R
N$18
  Bottom 0.305: RADIO.1 20.37,27.19 18.42,27.19 17.15,28.46 X2.1
N$21
  Top 0.305: R10.2 20.96,-1.39 21.59,-2.02 21.59,-8.21 21.21,-8.59 LED.B
N$22
  Bottom 0.305: C14.1 C11.1 -6.19,4.49 -5.39,3.69 1.46,3.69 3.25,1.91 U$3.VREF
N$24
  Top 0.305: R11.2 20.64,-3.29 20.96,-3.61 20.96,-6.94 20.71,-7.19 LED.G
N$26
  Top 0.305: D6.1 -15.87,28.46 -16.79,27.54 COM-00001.3
N$28
  Bottom 0.406: D4.C D5.C -8.26,50.15 arc-90 F1.1
N$29  (via drill 0.6 pad 1.27)
  Top 0.305: IC1.3 -3.87,29.98 -5.39,28.46 v-6.98,28.46
  Bottom 0.305: COM-00002.5 -1.6,23.13 -2.12,23.13 -2.88,23.89 -2.88,25.36 -3.59,26.07 -4.59,26.07 v-6.98,28.46
N$30
  Bottom 0.305: 2.23,7.43 C13.1 2.23,6.55 | 2.23,5.6 2.23,4.85 4.25,2.83 U$3.XOUT | 2.23,5.92 2.23,6.55 | 16MHZ.1 1.71,6.04 | 1.71,6.04 1.91,6.23 | 1.91,6.23 2.23,6.55 | 1.71,6.04 1.79,6.04 2.23,5.6 | 2.23,5.6 2.23,5.92 | 2.23,5.92 1.91,6.23
N$31
  Bottom 0.305: C12.1 -3.17,10.68 -3.81,10.04 -3.81,8.39 16MHZ.3 -3.72,8.3 -2.38,8.3 -1.9,7.82 -1.9,5.6 -0.95,4.65 1.48,4.65 3.75,2.37 U$3.XIN
N$39  (via drill 0.6 pad 1.27)
  Top 0.305: COM-00001.2 -15.87,21.79 -15.24,22.43 -15.24,25.92 v-14.6,26.55 | v-14.6,31.32 -6.98,31.32 -6.35,30.68 -5.39,30.68 -5.17,30.9 IC1.1
  Bottom 0.305: v-14.6,26.55 v-14.6,31.32
N$43
  Top 0.305: R12.2 -9.27,24.29 COM-00001.6 -11.14,27.54 -12.06,28.46 D6.2
N$44  (via drill 0.6 pad 1.27)
  Top 0.305: IC1.2 -4.52,30.6 -5.08,30.05 -7.93,30.05 -8.89,29.09 v-8.89,27.82
  Bottom 0.305: v-8.89,27.82 -9.52,27.19 -9.52,23.7 -8.89,23.06 COM-00002.2
ONEWIRE  (via drill 0.6 pad 1.27)
  Top 0.305: A2.1 A3.1 -12.97,-3.88 X1.1 | v-9.36,-10.91 2.54,-10.91 2.86,-10.59 2.86,-9.97 ONSTART1.3 2.05,-9.07 2.05,-5.13 ONSTART1.6
  Bottom 0.305: A2.1 A3.1 -12.78,-3.69 -12.78,-9.4 | v-9.36,-10.91 -11.27,-10.91 -12.78,-9.4 | A4.1 -16.03,-13.93 -16.03,-11.07 -14.28,-9.32 -12.85,-9.32 -12.78,-9.4
ONSTART  (via drill 0.6 pad 1.27)
  Top 0.305: v-10.16,17.66 -11.43,16.39 -11.43,15.12 -10.47,14.17 -9.49,14.17 X3.2 -8.16,14.08 0,5.92 5.72,5.92 v6.67,4.96 | v-8.57,3.38 ONSTART.5
  Bottom 0.305: v-8.57,3.38 -10.16,3.38 -12.06,5.28 -12.06,15.76 v-10.16,17.66 -9.2,16.71 -8.25,16.71 -7.19,17.77 COM-00002.3 -7.02,20.56 | v6.67,4.96 5.75,4.04 U$3.P1.0
REDLED  (via drill 0.6 pad 1.27)
  Top 0.305: v16.51,-5.2 R9.1
  Bottom 0.305: U$3.P2.5 15.12,-4.75 15.56,-5.2 v16.51,-5.2
RTS  (via drill 0.6 pad 1.27)
  Top 0.305: v-5.39,-3.93 -6.66,-2.66 -6.66,8.77 -7.97,10.08 X3.6
  Bottom 0.305: U$3.TCK -2.54,-4.25 -2.96,-4.66 R7.1 -4.02,-4.88 -4.44,-4.88 v-5.39,-3.93
RXANT
  Bottom 0.305: RADIO.3 20.24,23.06 19.05,23.06 14.93,18.93 14.93,1.79 11.39,-1.75 U$3.P1.7
TXANT
  Bottom 0.305: RADIO.4 20.02,20.84 19.05,20.84 15.88,17.66 15.88,1.79 11.84,-2.25 U$3.P2.0
UCA0RXD
  Top 0.305: ONSTART1.1 7.9,-9.74 6.79,-8.62 5.96,-8.62 5.4,-8.07 5.4,-6.68 4.13,-5.41 4.13,-0.12 -8.07,12.08 X3.4 -14.74,12.08 -16.79,14.14 COM-00001.1
UCA0TXD
  Top 0.305: COM-00001.4 -11.14,18.27 -11.43,17.98 -14.28,17.98 -14.92,17.35 -14.92,13.54 -14.47,13.08 X3.3 -8.12,13.08 7.9,-2.93 ONSTART1.4
UCA1CLK
  Bottom 0.305: UCA1CLK.1 2.25,-12.47 U$3.P5.0
UCA1RXD
  Bottom 0.305: UCA1RXD.1 7.62,-13.45 6.75,-12.58 U$3.P3.7
UCA1TXD
  Bottom 0.305: UCA1TXD.1 7.25,-11.81 U$3.P3.6
UCB1CLK
  Bottom 0.305: UCB1CLK.1 -7.62,-13.45 -5.71,-11.55 0.32,-11.55 0.75,-11.12 U$3.P5.3
UCB1SIMO
  Bottom 0.305: UCB1SIMO.1 -2.54,-13.45 -1.9,-12.82 0.96,-12.82 1.75,-12.02 U$3.P5.1
UCB1SOMI
  Bottom 0.305: UCB1SOMI.1 -5.08,-13.45 -3.81,-12.18 0.64,-12.18 1.25,-11.57 U$3.P5.2
V+  (via drill 0.6 pad 1.27)
  Top 0.305: IC1.20 0.03,35.1 0.96,34.17 5.09,34.17 C3.1 v7.62,33.86
  Top 0.406: C2.1 -10.47,33.22 | -10.47,33.22 -11.64,34.39 R1.1 R2.1 -11.74,38.09 v-11.74,40.84 -7.46,40.84 -4.6,43.7 5.08,43.7 6.04,44.66 JP1.VBUS | -10.47,33.22 v-14.6,33.22
  Bottom 0.305: v7.62,33.86 0.96,27.19 -3.81,27.19 -6.66,30.05 -11.43,30.05 v-14.6,33.22
  Bottom 0.406: D4.A -13.33,42.43 v-11.74,40.84
  pour Top: -11.74,34.49 -13.01,33.22 -10.47,33.22
VCC  (1 unrouted)
  Bottom 0.305: R5.2 11.98,49.72 | JP3.1 16.68,39.57 2.21,39.57 -0.01,41.79 0,41.79 -0.77,42.57 C15.1
  Bottom 0.406: F1.2 -5.36,50.05 C15.1 -0.77,51.9 0.02,52.69 10.99,52.69 11.97,51.71 R5.2 | 11.98,49.72 REG2.VIN

### Text on the board
Document: 3V3 | GND | Vcc | One-Wire | UART | Dev-Board V3.5 | VM | RUN | O-W | One-Wire | UART | GND | 3V3 | RESET | 1
200bmp: aking | by | earning